# EAGLE design shield (EAGLE 7.7.0)
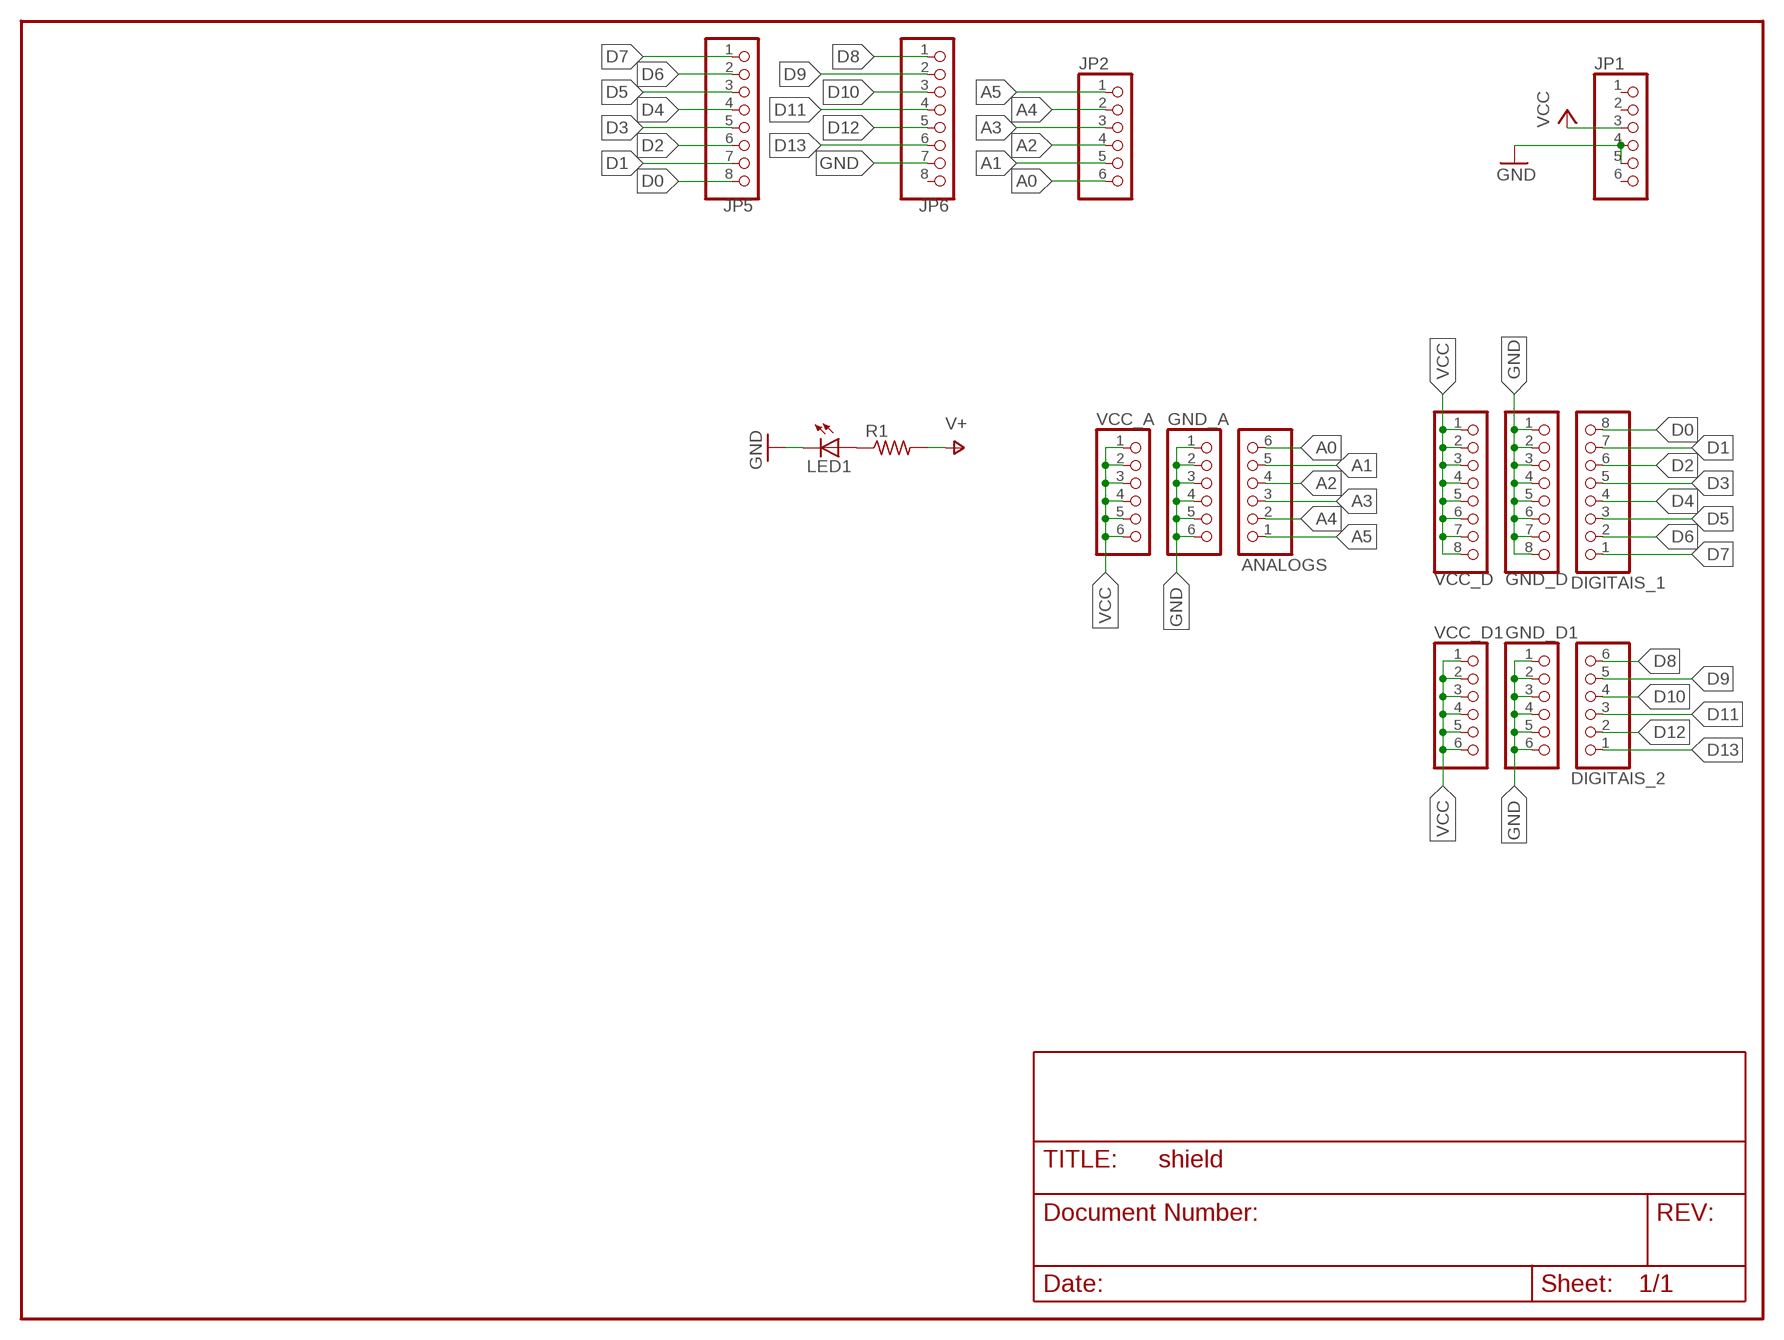
[diagram p0: schematic, sheet 1]

## Parts
ANALOGS  PINHD-1X6  [1X06]
DIGITAIS_1  PINHD-1X8  [1X08]
DIGITAIS_2  PINHD-1X6  [1X06]
GND_A  PINHD-1X6  [1X06]
GND_D  PINHD-1X8  [1X08]
GND_D1  PINHD-1X6  [1X06]
JP1  PINHD-1X6  [1X06]
JP2  PINHD-1X6  [1X06]
JP5  PINHD-1X8  [1X08]
JP6  PINHD-1X8  [1X08]
LED1  LED3MM  [LED3MM]
R1  R-US_0207/10  [0207/10]
VCC_A  PINHD-1X6  [1X06]
VCC_D  PINHD-1X8  [1X08]
VCC_D1  PINHD-1X6  [1X06]

## Nets
A0: ANALOGS.6 JP2.6
A1: ANALOGS.5 JP2.5
A2: ANALOGS.4 JP2.4
A3: ANALOGS.3 JP2.3
A4: ANALOGS.2 JP2.2
A5: ANALOGS.1 JP2.1
D0: DIGITAIS_1.8 JP5.8
D1: DIGITAIS_1.7 JP5.7
D2: DIGITAIS_1.6 JP5.6
D3: DIGITAIS_1.5 JP5.5
D4: DIGITAIS_1.4 JP5.4
D5: DIGITAIS_1.3 JP5.3
D6: DIGITAIS_1.2 JP5.2
D7: DIGITAIS_1.1 JP5.1
D8: DIGITAIS_2.6 JP6.1
D9: DIGITAIS_2.5 JP6.2
D10: DIGITAIS_2.4 JP6.3
D11: DIGITAIS_2.3 JP6.4
D12: DIGITAIS_2.2 JP6.5
D13: DIGITAIS_2.1 JP6.6
GND [power]: GND_A.1 GND_A.2 GND_A.3 GND_A.4 GND_A.5 GND_A.6 GND_D1.1 GND_D1.2 GND_D1.3 GND_D1.4 GND_D1.5 GND_D1.6 GND_D.1 GND_D.2 GND_D.3 GND_D.4 GND_D.5 GND_D.6 GND_D.7 GND_D.8 JP1.4 JP1.5 JP6.7 LED1.K(C)
N$35: LED1.A R1.1
VCC: JP1.3 R1.2 VCC_A.1 VCC_A.2 VCC_A.3 VCC_A.4 VCC_A.5 VCC_A.6 VCC_D1.1 VCC_D1.2 VCC_D1.3 VCC_D1.4 VCC_D1.5 VCC_D1.6 VCC_D.1 VCC_D.2 VCC_D.3 VCC_D.4 VCC_D.5 VCC_D.6 VCC_D.7 VCC_D.8 ; supply symbol labelled V+
Unconnected: JP1.1 JP1.2 JP1.6 JP6.8

## Library data of the parts
ANALOGS DIGITAIS_2 GND_A GND_D1 JP1 JP2 VCC_A VCC_D1 = pinhead:PINHD-1X6: PIN HEADER
DIGITAIS_1 GND_D JP5 JP6 VCC_D = pinhead:PINHD-1X8: PIN HEADER
LED1 = minimidi:LED: LED OSRAM: - CHIPLED LG R971, LG N971, LY N971, LG Q971, LY Q971, LO R971, LY R971 LH N974, LH R974 LS Q976, LO Q976, LY Q976 LO Q996 - Hyper CHIPLED LW Q18S LB Q993, LB Q99A, LB R99A - SideLED LS A670, LO A670, LY A670, LG A670, LP A670 LB A673, LV A673, LT A673, LW A673 LH A674 LY A675 LS A676, LA A676, LO A676, LY A676, LW A676 LS A679, LY A679, LG A679 - Hyper Micro SIDELED® LS Y876, LA Y876, LO Y876, LY Y876 LT Y87S - SmartLED LW L88C, LW L88S LB L89C, LB L89S, LG L890 LS L89K, LO L89K, LY L89K LS L896, LA L896, LO L896, LY L896 - TOPLED LS T670, LO T670, LY T670, LG T670, LP T670 LSG T670, LSP T670, LSY T670, LOP T670, LYG T670 LG T671, LOG T671, LSG T671 LB T673, LV T673, LT T673, LW T673 LH T674 LS T676, LA T676, LO T676, LY T676, LB T676, LH T676, LSB T676, LW T676 LB T67C, LV T67C, LT T67C, LS T67K, LO T67K, LY T67K, LW E67C LS E67B, LA E67B, LO E67B, LY E67B, LB E67C, LV E67C, LT E67C LW T67C LS T679, LY T679, LG T679 LS T770, LO T770, LY T770, LG T770, LP T770 LB T773, LV T773, LT T773, LW T773 LH T774 LS E675, LA E675, LY E675, LS T675 LS T776, LA T776, LO T776, LY T776, LB T776 LHGB T686 LT T68C, LB T68C - Hyper Mini TOPLED® LB M676 - Mini TOPLED Santana® LG M470 LS M47K, LO M47K, LY M47K Source: http://www.osram.convergy.de/
R1 = rcl-ez:R-US_: RESISTOR, American symbol

## Net classes
1 power: width 0.61 mm

## Board
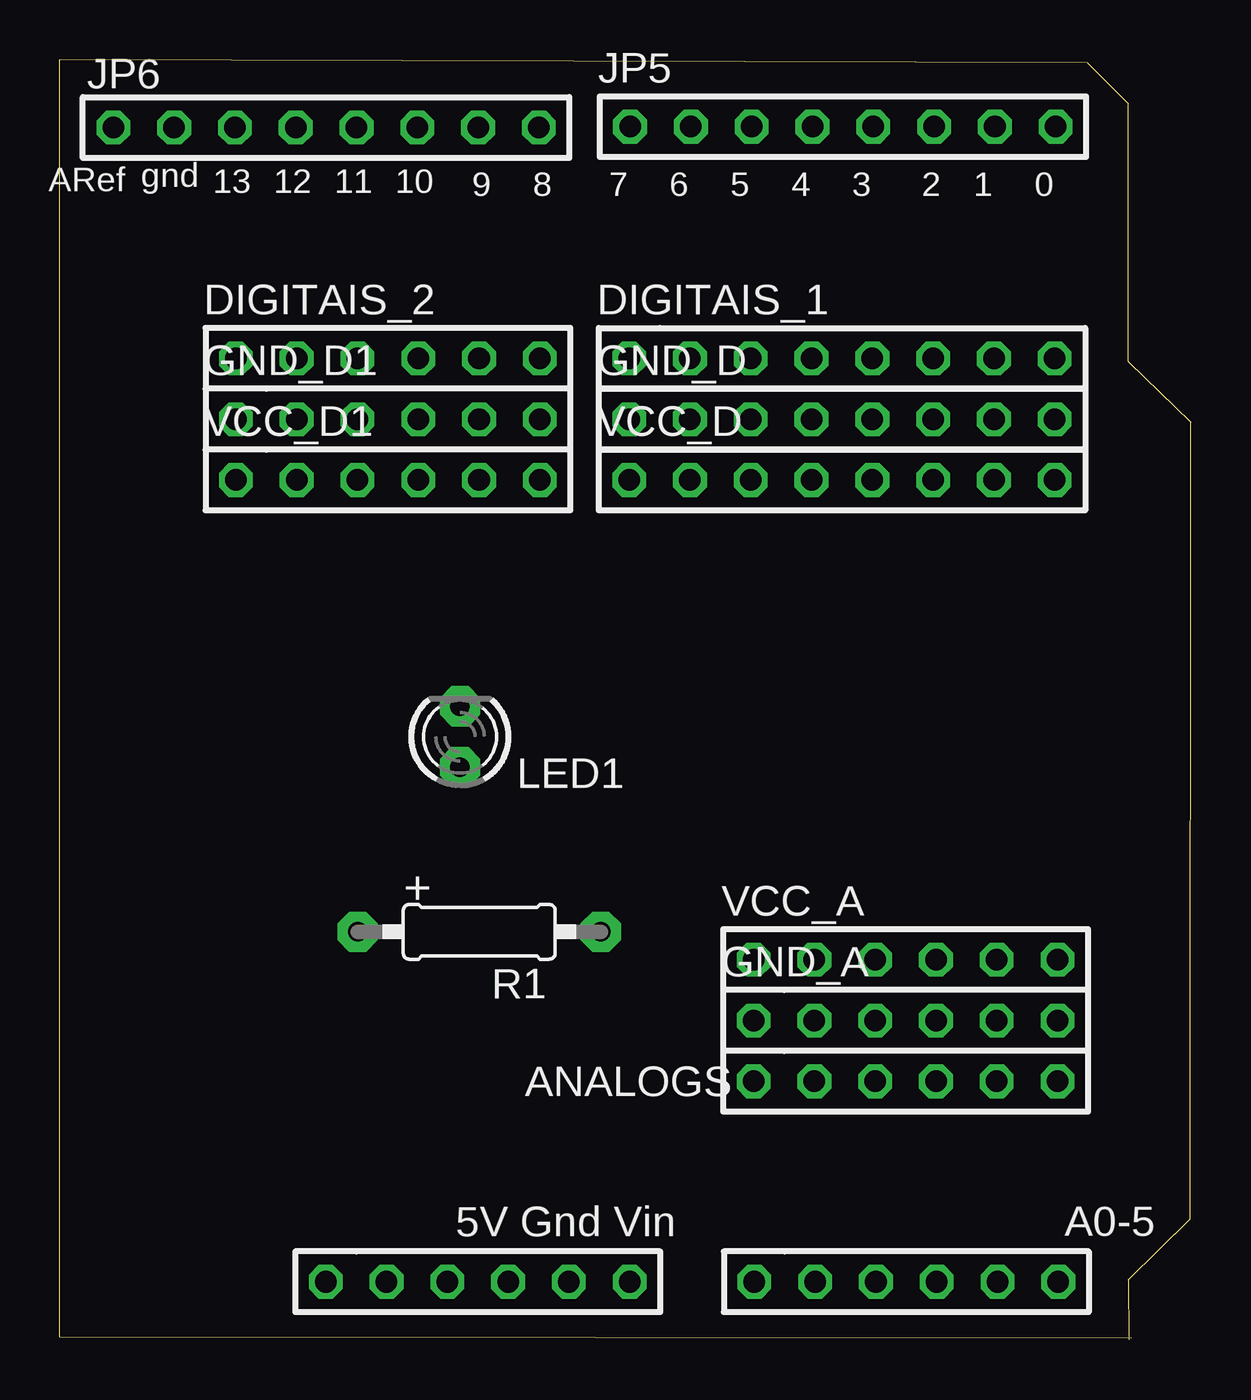
[diagram p1: board, top side]
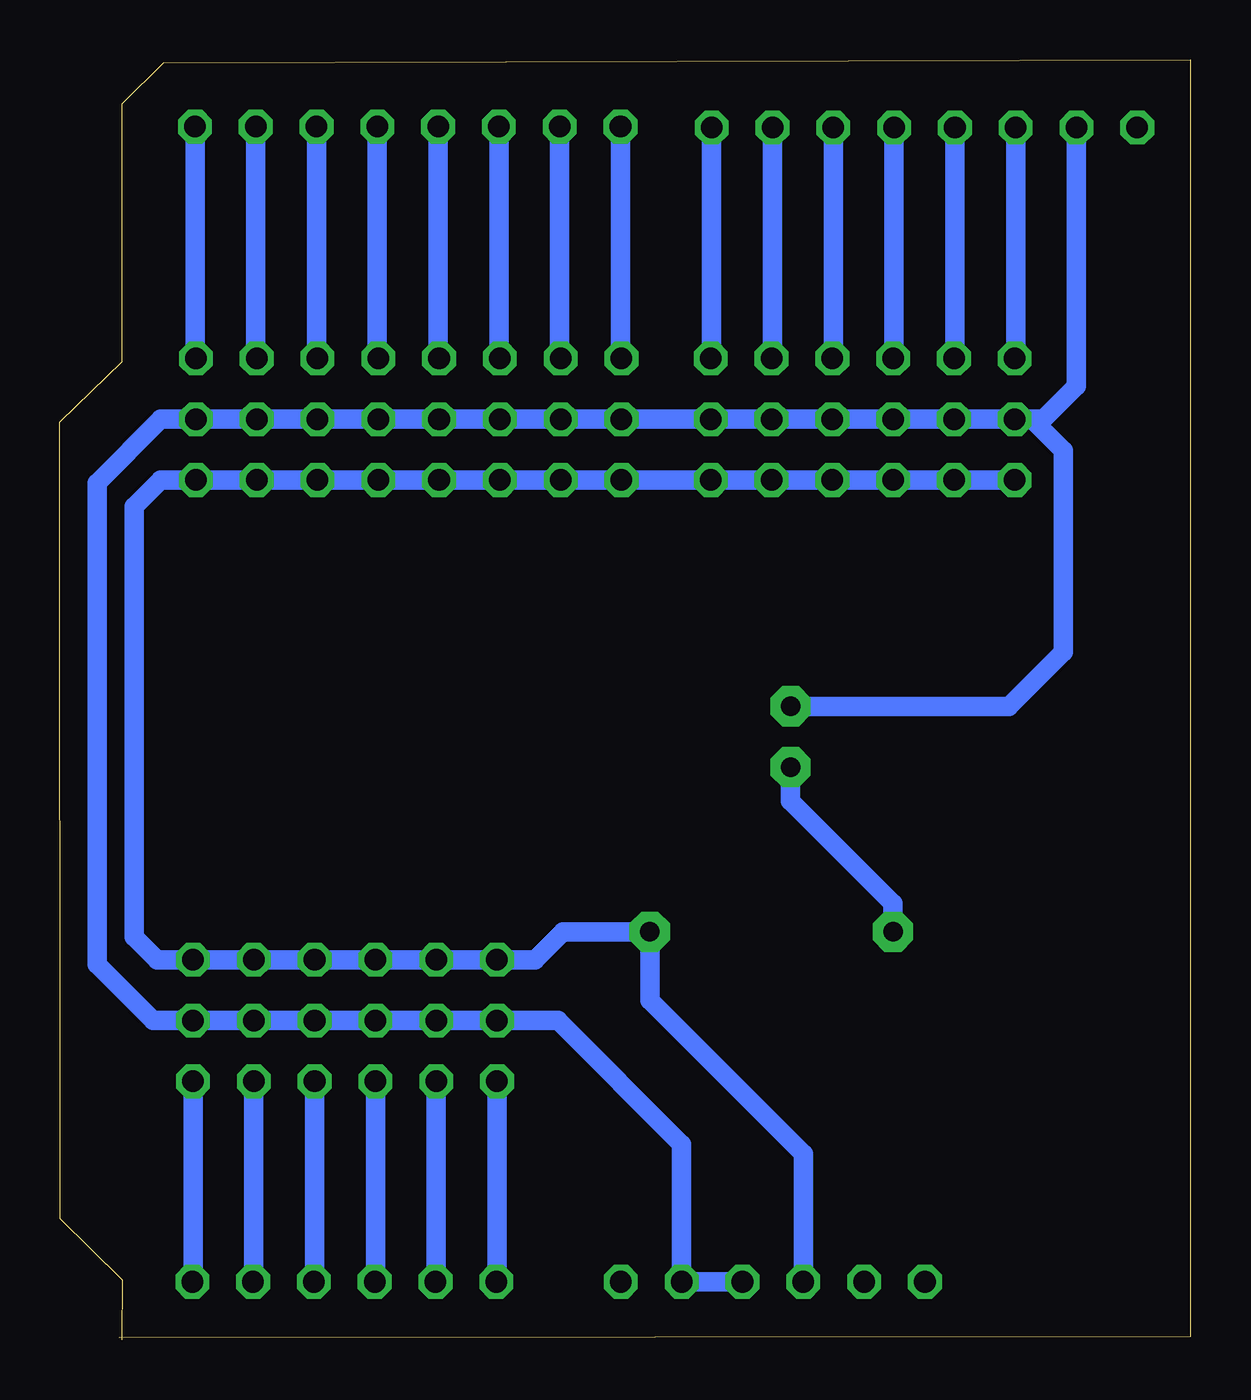
[diagram p2: board, bottom side, seen from below]

Size 47.25 x 53.47 mm. Coordinates in mm from the lower left corner, seen from the top.
Outline: 47.22,5.05 47.22,5.05
Outline: 47.22,5.05 47.25,38.33 44.65,40.87 44.65,51.63 42.92,53.35 0,53.47 0,0.12 44.77,0.09
Outline: 47.22,5.05 44.65,2.5 44.66,0
Copper layers (1*16): Top 0.035mm / dielectric 1.5mm / Bottom 0.035mm
Design rules "default": minimum track width 16mil, minimum drill 19mil, track to track 12mil, track to pad 12mil, pad to pad 12mil, via to via 12mil, smd to smd 0mil, copper to edge 10mil, drill to drill 8mil, minimum pad ring 10mil, minimum via ring 8mil, stop-mask expansion 4mil, vias tented up to drill 0mil, thermal gap 10mil

### Footprints (pad centres in the part's own frame; a part is rotated, then mirrored left to right if it is on the bottom)
1X06 = drill 0.9 octagon: 1 -6.35,0; 2 -3.81,0; 3 -1.27,0; 4 1.27,0; 5 3.81,0; 6 6.35,0
1X08 = drill 0.9 octagon: 1 -8.89,0; 2 -6.35,0; 3 -3.81,0; 4 -1.27,0; 5 1.27,0; 6 3.81,0; 7 6.35,0; 8 8.89,0
LED3MM = drill 0.813 pad 1.676 octagon: A -1.27,0; K 1.27,0
0207/10 = drill 0.813 pad 1.676 octagon: 1 -5.08,0; 2 5.08,0

### Placement (x,y rotation side)
ANALOGS  35.33,10.79 0 top
DIGITAIS_1  32.68,40.99 0 top
DIGITAIS_2  13.7,40.99 0 top
GND_A  35.33,13.33 0 top
GND_D  32.68,38.45 0 top
GND_D1  13.7,38.45 0 top
JP1  17.46,2.42 0 top
JP2  35.37,2.42 0 top
JP5  32.72,50.68 0 top
JP6  11.13,50.64 180 top
LED1  16.72,25.19 90 top
R1  17.52,17.04 0 top
VCC_A  35.33,15.87 0 top
VCC_D  32.68,35.91 0 top
VCC_D1  13.7,35.91 0 top

### Tracks (layer width: path | path; a pad name or v marks a point on that pad's centre or on a via)
A0
  Bottom 0.813: ANALOGS.6 41.68,2.45 JP2.6
A1
  Bottom 0.813: ANALOGS.5 39.14,2.45 JP2.5
A2
  Bottom 0.813: ANALOGS.4 36.6,2.45 JP2.4
A3
  Bottom 0.813: ANALOGS.3 34.06,2.45 JP2.3
A4
  Bottom 0.813: JP2.2 31.52,2.42 ANALOGS.2
A5
  Bottom 0.813: JP2.1 28.98,2.42 ANALOGS.1
D0
  Bottom 0.813: JP5.8 41.6,41.03 DIGITAIS_1.8
D1
  Bottom 0.813: JP5.7 39.06,41.03 DIGITAIS_1.7
D2
  Bottom 0.813: JP5.6 36.52,41.03 DIGITAIS_1.6
D3
  Bottom 0.813: JP5.5 33.98,41.03 DIGITAIS_1.5
D4
  Bottom 0.813: JP5.4 31.44,41.03 DIGITAIS_1.4
D5
  Bottom 0.813: JP5.3 28.9,41.03 DIGITAIS_1.3
D6
  Bottom 0.813: JP5.2 26.36,41.03 DIGITAIS_1.2
D7
  Bottom 0.813: JP5.1 23.82,41.03 DIGITAIS_1.1
D8
  Bottom 0.813: JP6.1 20.01,41.03 DIGITAIS_2.6
D9
  Bottom 0.813: JP6.2 17.47,41.03 DIGITAIS_2.5
D10
  Bottom 0.813: JP6.3 14.93,41.03 DIGITAIS_2.4
D11
  Bottom 0.813: JP6.4 12.39,41.03 DIGITAIS_2.3
D12
  Bottom 0.813: JP6.5 9.85,41.03 DIGITAIS_2.2
D13
  Bottom 0.813: JP6.6 7.31,41.03 DIGITAIS_2.1
GND
  Bottom 0.813: JP1.4 JP1.5 21.27,8.16 26.44,13.33 GND_A.1 GND_A.2 GND_A.3 GND_A.4 GND_A.5 GND_A.6 43.35,13.33 45.69,15.67 45.69,35.8 43.03,38.45 GND_D.8 GND_D.7 GND_D.6 GND_D.5 GND_D.4 GND_D.3 GND_D.2 GND_D.1 GND_D1.6 GND_D1.5 GND_D1.4 GND_D1.3 GND_D1.2 GND_D1.1 6.64,38.45 | 6.64,38.45 6.16,38.45 4.77,39.84 JP6.7 | LED1.K 7.6,26.46 5.33,28.73 5.33,37.14 6.64,38.45
N$35
  Bottom 0.813: R1.1 12.44,18.22 16.72,22.5 LED1.A
VCC
  Bottom 0.813: JP1.3 16.19,7.76 22.6,14.17 R1.2 26.23,17.04 27.4,15.87 VCC_A.1 VCC_A.2 VCC_A.3 VCC_A.4 VCC_A.5 VCC_A.6 43.19,15.87 44.14,16.82 44.14,34.8 43.03,35.91 VCC_D.8 VCC_D.7 VCC_D.6 VCC_D.5 VCC_D.4 VCC_D.3 VCC_D.2 VCC_D.1 VCC_D1.6 VCC_D1.5 VCC_D1.4 VCC_D1.3 VCC_D1.2 VCC_D1.1

### Text on the board
tPlace: ARef | gnd | 13 | 12 | 11 | 10 | 9 | 8 | 7 | 6 | 5 | 4 | 3 | 2 | 1 | 0 | + | A0-5
tNames: 5V Gnd Vin